# Altium schematic sheet BQ25798_PMIC.SchDoc
size A; SheetNumber: 3; SheetTotal: 6
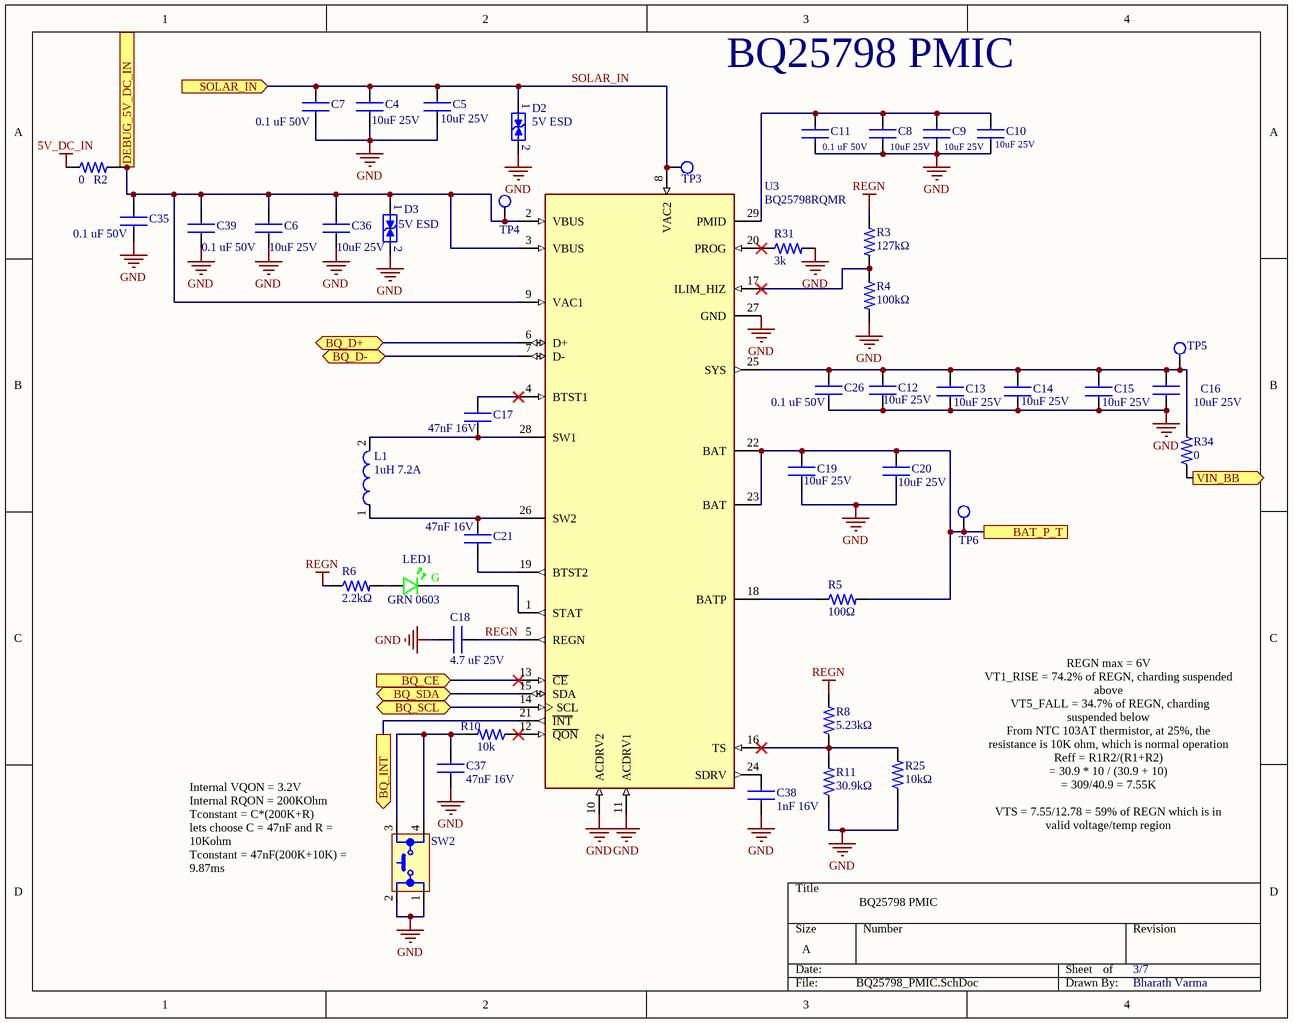
[diagram p0: BQ25798_PMIC.SchDoc]

## Parts
C4  10uF 25V  [CAP_10]
C5  10uF 25V  [CAP_10]
C6  10uF 25V  [CAP_10]
C7  0.1 uF 50V  [CAPC1608X90N]
C8  10uF 25V  [CAP_10]
C9  10uF 25V  [CAP_10]
C10  10uF 25V  [CAP_10]
C11  0.1 uF 50V  [CAPC1608X90N]
C12  10uF 25V  [CAP_10]
C13  10uF 25V  [CAP_10]
C14  10uF 25V  [CAP_10]
C15  10uF 25V  [CAP_10]
C16  10uF 25V  [CAP_10]
C17  47nF 16V  [CAPC1608X90N]
C18  4.7 uF 25V  [CAPC1608X90N]
C19  10uF 25V  [CAP_10]
C20  10uF 25V  [CAP_10]
C21  47nF 16V  [CAPC1608X90N]
C26  0.1 uF 50V  [CAPC1608X90N]
C35  0.1 uF 50V  [CAPC1608X90N]
C36  10uF 25V  [CAP_10]
C37  47nF 16V  [CAPC1608X90N]
C38  1nF 16V  [CAPC1608X90N]
C39  0.1 uF 50V  [CAPC1608X90N]
D2  5V ESD  [WE-TVS_DFN1610-2L]
D3  5V ESD  [WE-TVS_DFN1610-2L]
L1  1uH 7.2A  [WE-MAPI_4020]
LED1  GRN 0603  [LED_0603_GRN_WL-SMCW]
R2  0  [RES_0603_1608X06]
R3  127kΩ  [RESC1508X55N]
R4  100kΩ  [RESC1508X55N]
R5  100Ω  [RESC1508X55N]
R6  2.2kΩ  [RESC1508X55N]
R8  5.23kΩ  [RESC1508X55N]
R10  10k  [RES_0603_1608X06]
R11  30.9kΩ  [RESC1508X55N]
R25  10kΩ  [RES_0603_1608X06]
R31  3k  [RES_0603_1608X06]
R34  0  [RES_0603_1608X06]
SW2  (no value)  [1825910-6_BUTTON]
TP3  Test Point  [Test Point]  (value not drawn)  (net tie, no BOM)
TP4  Test Point  [Test Point]  (value not drawn)  (net tie, no BOM)
TP5  Test Point  [Test Point]  (value not drawn)  (net tie, no BOM)
TP6  Test Point  [Test Point]  (value not drawn)  (net tie, no BOM)
U3  BQ25798RQMR  [BQ25798RQMR]

## Ports
BAT_P_T (see mech_comp[2B]), BQ_CE (in, see ESP32_SoC[4C]), BQ_D+ (bidir, see CP2102_USB_UART[2C]), BQ_D- (bidir, see CP2102_USB_UART[2C]), BQ_INT (out, see ESP32_SoC[4B]), BQ_SCL (bidir, see ESP32_SoC[4B]), BQ_SDA (bidir, see ESP32_SoC[4B]), DEBUG_5V_DC_IN (in, see mech_comp[1C]), SOLAR_IN (in, see mech_comp[2B]), VIN_BB (out, see TPS_BUCK_BOOST[1B])

## Nets
5V_DC_IN: R2.1
GND: C4.2 C5.2 C6.2 C7.2 C8.2 C9.2 C10.2 C11.2 C12.2 C13.2 C14.2 C15.2 C16.2 C18.1 C19.2 C20.2 C26.2 C35.2 C36.2 C37.2 C38.2 C39.2 D2.2(GND) D3.2(GND) R4.2 R11.1 R25.1 R31.2 SW2.1 SW2.2 U3.10(ACDRV2) U3.11(ACDRV1) U3.27(GND)
REGN: C18.2 R3.1 R6.1 R8.2 U3.5(REGN)
BAT_P_T: C19.1 C20.1 R5.2 TP6.1 U3.22(BAT) U3.23(BAT) ; port BAT_P_T
BQ_CE: U3.13(~{CE}) ; port BQ_CE
BQ_D+: U3.6(D+) ; port BQ_D+
BQ_D-: U3.7(D-) ; port BQ_D-
BQ_INT: U3.21(~{INT}) ; port BQ_INT
BQ_SCL: U3.14(SCL) ; port BQ_SCL
BQ_SDA: U3.15(SDA) ; port BQ_SDA
DEBUG_5V_DC_IN: C6.1 C35.1 C36.1 C39.1 D3.1(I/O) R2.2 TP4.1 U3.2(VBUS) U3.3(VBUS) U3.9(VAC1) ; port DEBUG_5V_DC_IN
SOLAR_IN: C4.1 C5.1 C7.1 D2.1(I/O) TP3.1 U3.8(VAC2) ; port SOLAR_IN
VIN_BB: R34.1 ; port VIN_BB
NetC8_1: C8.1 C9.1 C10.1 C11.1 U3.29(PMID)
NetC12_1: C12.1 C13.1 C14.1 C15.1 C16.1 C26.1 R34.2 TP5.1 U3.25(SYS)
NetC17_1: C17.1 U3.4(BTST1)
NetC17_2: C17.2 L1.2 U3.28(SW1)
NetC21_1: C21.1 L1.1 U3.26(SW2)
NetC21_2: C21.2 U3.19(BTST2)
NetC37_1: C37.1 R10.2 SW2.3 SW2.4
NetC38_1: C38.1 U3.24(SDRV)
NetLED1_A: LED1.A R6.2
NetLED1_C: LED1.C U3.1(STAT)
NetR3_2: R3.2 R4.1 U3.17(ILIM_HIZ)
NetR5_1: R5.1 U3.18(BATP)
NetR8_1: R8.1 R11.2 R25.2 U3.16(TS)
NetR10_1: R10.1 U3.12(~{QON})
NetR31_1: R31.1 U3.20(PROG)

## Notes on the sheet
- BQ25798 PMIC
- REGN max = 6V
  VT1_RISE = 74.2% of REGN, charding suspended above
  VT5_FALL = 34.7% of REGN, charding suspended below
  From NTC 103AT thermistor, at 25%, the resistance is 10K ohm, which is normal operation
  Reff = R1R2/(R1+R2)
  = 30.9 * 10 / (30.9 + 10)
  = 309/40.9 = 7.55K
  VTS = 7.55/12.78 = 59% of REGN which is in valid voltage/temp region
- (near SW2) Internal VQON = 3.2V
  Internal RQON = 200KOhm
  Tconstant = C*(200K+R)
  lets choose C = 47nF and R = 10Kohm
  Tconstant = 47nF(200K+10K) = 9.87ms
- 3/7
- Bharath Varma
- (in symbol 150060GS75000) G

## Library data of the parts
C4-C6 C8-C10 C12-C16 C19 C20 C36 = GRM21BR61E106KA73K: Ceramic Capacitor, Ceramic, 25V, 10% +Tol, 10% -Tol, X5R, 15% TC, 10uF, Surface Mount, 0805; Manufacturer: Murata; Manufacturer Lifecycle Status: IN PRODUCTION; Value: 10µF; Supplier: Avnet; Supplier Part Number: GRM21BR61E106KA73K; Manufacturer Part Number: GRM21BR61E106KA73K; RoHS: Compliant; Category: Ceramic Capacitors; Stock: 54000; Pricing: 10000=0.01987, 20000=0.01911, 40000=0.01892, 60000=0.01882, 80000=0.01872 (USD); Case/Package: 0805; Dielectric: X5R; Dielectric Material: Ceramic; Height: 1.25mm; Length: 2mm; Lifecycle Status: Production; Material: Ceramic; Max Operating Temperature: 85°C; Min Operating Temperature: -55°C; Mounting Technology: Surface Mount; Number of Terminals: 2; Packaging: Tape & Reel (TR); REACH SVHC: Yes; Schedule B: 8532240020, 8532240020|8532240020, 8532240020|8532240020|8532240020, 8532240020|8532240020|8532240020|8532240020; Thickness: 1.25mm; Tolerance: 10%; Voltage Rating: 25V; Voltage Rating (DC): 25V; Weight: 9.49709mg; Width: 1.25mm; ComponentLink1URL: https://datasheet.octopart.com:443/GRM21BR61E106KA73K-Murata-datasheet-149523495.pdf?src-supplier=Newark; ComponentLink1Description: https://datasheet.octopart.com:443/GRM21BR61E106KA73K-Murata-datasheet-149523495.pdf?src-supplier=Newark; ComponentLink2URL: https://datasheet.octopart.com:443/GRM21BR61E106KA73K-Murata-datasheet-141278247.pdf?src-supplier=Geoflip; ComponentLink2Description: https://datasheet.octopart.com:443/GRM21BR61E106KA73K-Murata-datasheet-141278247.pdf?src-supplier=Geoflip; ComponentLink3URL: https://datasheet.octopart.com:443/GRM21BR61E106KA73K-Murata-datasheet-165579666.pdf?src-supplier=TME; ComponentLink3Description: https://datasheet.octopart.com:443/GRM21BR61E106KA73K-Murata-datasheet-165579666.pdf?src-supplier=TME; ComponentLink4URL: https://datasheet.octopart.com:443/GRM21BR61E106KA73K-Murata-datasheet-140707569.pdf?src-supplier=Ciiva; ComponentLink4Description: https://datasheet.octopart.com:443/GRM21BR61E106KA73K-Murata-datasheet-140707569.pdf?src-supplier=Ciiva; ComponentLink5URL: https://datasheet.octopart.com:443/GRM21BR61E106KA73K-Murata-datasheet-138744870.pdf?src-supplier=Ciiva; ComponentLink5Description: https://datasheet.octopart.com:443/GRM21BR61E106KA73K-Murata-datasheet-138744870.pdf?src-supplier=Ciiva; ComponentLink6URL: https://datasheet.octopart.com:443/GRM21BR61E106KA73K-Murata-datasheet-99353849.pdf?src-supplier=Future+Electronics; ComponentLink6Description: https://datasheet.octopart.com:443/GRM21BR61E106KA73K-Murata-datasheet-99353849.pdf?src-supplier=Future+Electronics; ComponentLink7URL: https://datasheet.octopart.com/GRM21BR61E106KA73K-Murata-datasheet-12515295.pdf; ComponentLink7Description: https://datasheet.octopart.com/GRM21BR61E106KA73K-Murata-datasheet-12515295.pdf; ComponentLink8URL: https://datasheet.octopart.com/GRM21BR61E106KA73K-Murata-datasheet-12510076.pdf; ComponentLink8Description: https://datasheet.octopart.com/GRM21BR61E106KA73K-Murata-datasheet-12510076.pdf; ComponentLink9URL: https://datasheet.octopart.com/GRM21BR61E106KA73K-Murata-datasheet-11978611.pdf; ComponentLink9Description: https://datasheet.octopart.com/GRM21BR61E106KA73K-Murata-datasheet-11978611.pdf; ComponentLink10URL: https://datasheet.octopart.com/GRM21BR61E106KA73K-Murata-datasheet-10025737.pdf; ComponentLink10Description: https://datasheet.octopart.com/GRM21BR61E106KA73K-Murata-datasheet-10025737.pdf; ComponentLink11URL: https://datasheet.octopart.com/GRM21BR61E106KA73K-Murata-datasheet-8819587.pdf; ComponentLink11Description: https://datasheet.octopart.com/GRM21BR61E106KA73K-Murata-datasheet-8819587.pdf; ComponentLink12URL: https://datasheet.octopart.com/GRM21BR61E106KA73K-Murata-datasheet-14397508.pdf; ComponentLink12Description: https://datasheet.octopart.com/GRM21BR61E106KA73K-Murata-datasheet-14397508.pdf; ComponentLink13URL: http://sigma.octopart.com:80/reach_statement/Murata-company-16.pdf?src-supplier=Compliance+Statements; ComponentLink13Description: http://sigma.octopart.com:80/reach_statement/Murata-company-16.pdf?src-supplier=Compliance+Statements; Supplier 1: DigiKey; Supplier Part Number 1: 490-16824-1-ND
C7 C11 C26 C35 C39 = GCM31C5C1H104FA16L: 0.10uF Tol.1%. Rated voltage 50Vdc 125C SMD capacitor C0G(EIA) with capacitance; MF: Murata; Check_prices: https://www.snapeda.com/parts/GCM31C5C1H104FA16L/Murata/view-part/?ref=eda; Value: *; MP: GCM31C5C1H104FA16L; Purchase-URL: https://pricing.snapeda.com/search/part/GCM31C5C1H104FA16L/?ref=eda; SnapEDA_Link: https://www.snapeda.com/parts/GCM31C5C1H104FA16L/Murata/view-part/?ref=snap; Package: 3216 Murata; Digi-Key_Part_Number: 490-GCM31C5C1H104FA16LTR-ND
C17 C21 C37 = CC0603KRX7R7BB473: CAPACITOR CERAMIC 0.047UF 16V, X7R, 10%,; Package: None; Price: None; Value: *; MP: CC0603KRX7R7BB473; Availability: Unavailable
C18 = GRM188R61E475KE11D: Ceramic capacitor SMD 0603 4.7 µF 25 V 10 % (L x W x H) 1.6 x 0.8 x 0.8 mm Murata GRM188R61E475KE11D 4000 pc(s); MF: Murata Electronics; SnapEDA_Link: https://www.snapeda.com/parts/GRM188R61E475KE11D/Murata+Electronics+North+America/view-part/?ref=snap; Package: 1608 Murata; Value: *; MP: GRM188R61E475KE11D; Check_prices: https://www.snapeda.com/parts/GRM188R61E475KE11D/Murata+Electronics+North+America/view-part/?ref=eda
C38 = CC0603KRX7R7BB102: 1000pF ±10% 16V Ceramic Capacitor X7R 0603 (1608 Metric); MF: Yageo; Digi-Key_Part_Number: 311-4063-1-ND; Check_prices: https://www.snapeda.com/parts/CC0603KRX7R7BB102/Yageo/view-part/1821143/?ref=eda; Package: 0603 Yageo; Purchase-URL: https://pricing.snapeda.com/search/part/CC0603KRX7R7BB102/?ref=eda; Value: *; MP: CC0603KRX7R7BB102; SnapEDA_Link: https://www.snapeda.com/parts/CC0603KRX7R7BB102/Yageo/view-part/1821143/?ref=snap
D2 D3 = WE-TVS_DFN1610-2L_824032815: MF: {'manufacturer': u'W\xfcrth Elektronik'}; Package: None; Price: None; Value: *; MP: 824032815; Availability: Unavailable
L1 = WE-MAPI_4020: 1 ÂµH Shielded Molded Inductor 7.2 A 15mOhm Max 1616 (4040 Metric); MF: WÃ¼rth Elektronik; MP: 74438356010; Package: SMD-2; Price: None; Value: *; SnapEDA_Link: https://www.snapeda.com/parts/74438356010/W%25C3%25BCrth+Elektronik+Midcom/view-part/?ref=snap; Availability: Unavailable; Check_prices: https://www.snapeda.com/parts/74438356010/W%25C3%25BCrth+Elektronik+Midcom/view-part/?ref=eda
LED1 = 150060GS75000: LED, 0603, GREEN, 430MCD, 520NM; Manufacturer: Wurth Electronics; Dynamic Catalog: 0603 Rectangle with Flat Top Chip LEDs; 3D Model: SMCW_0603.igs / SMCW_0603.stp / SMCW_0603.wrl; Wavelength - Peak: 515nm; Voltage - Forward (Vf) (Typ): 3.2V; Current - Test: 20mA; Viewing Angle: 140°; Lens Type: Clear; Lens Style/Size: Rectangle with Flat Top, 1.1mm x 0.7mm; Other Names: 732-4971-2; Supplier 1: Digi-Key; Manufacturer Part Number: 150060GS75000; Stock 1: 34964; Pricing 1: 1=0.14, 50=0.129, 100=0.11, 500=0.095 (USD); Standard Package: 4,000; Category: Optoelectronics; Family: LED Indication - Discrete; Series: WL-SMCW; Packaging: Tape & Reel (TR); Color: Green; Wavelength - Dominant: 520nm; Millicandela Rating: 430mcd; Package / Case: 0603 (1608 Metric); Size / Dimension: 1.60mm L x 0.80mm W; Height: 0.70mm; Mounting Type: Surface Mount; Online Catalog: 0603 Rectangle with Flat Top Chip LEDs; ComponentLink1URL: https://katalog.we-online.de/led/datasheet/150060GS75000.pdf?src-supplier=Digi-Key; ComponentLink1Description: https://katalog.we-online.de/led/datasheet/150060GS75000.pdf?src-supplier=Digi-Key; ComponentLink2URL: http://www.produktinfo.conrad.com/datenblaetter/750000-774999/759427-da-01-en-CHIPLED_0603_W_KL_GRUEN_150060GS75000.pdf?src-supplier=Conrad; ComponentLink2Description: http://www.produktinfo.conrad.com/datenblaetter/750000-774999/759427-da-01-en-CHIPLED_0603_W_KL_GRUEN_150060GS75000.pdf?src-supplier=Conrad; Supplier Part Number 1: 732-4971-1-ND
R2 R34 = MCT06030Z0000ZP500: 0 Ohms Jumper 0.125W, 1/8W Chip Resistor 0603 (1608 Metric) Anti-Sulfur Thin Film; MF: Vishay; SnapEDA_Link: https://www.snapeda.com/parts/MCT06030Z0000ZP500/Vishay+Beyschlag/view-part/?ref=snap; Package: 1508 Vishay; Value: *; MP: MCT06030Z0000ZP500; Check_prices: https://www.snapeda.com/parts/MCT06030Z0000ZP500/Vishay+Beyschlag/view-part/?ref=eda
R3 = RMCF0603FT127K: RES 127K OHM 1% 1/10W 0603; Package: None; Price: None; Value: *; MP: RMCF0603FT127K; Availability: Unavailable
R4 = RMCF0603JT100K: RMCF Series 0603 0.1 W 100 kOhm Â±5 % Â±100 ppm/Â°C SMT Thick Film Chip Resistor; MF: Stackpole Electronics; Package: 0603 Stackpole Electronics; Value: *; MP: RMCF0603JT100K; Price: None; Availability: Good; SnapEDA_Link: https://www.snapeda.com/parts/RMCF0603JT100K/Stackpole%20Electronics/view-part/54539/?ref=snap; Purchase-URL: https://pricing.snapeda.com/search/part/RMCF0603JT100K/?ref=eda
R5 = RN73H1JTTD1000B25: RES 100 OHM 0.1% 1/10W 0603; Package: None; Price: None; Value: *; MP: RN73H1JTTD1000B25; Availability: Unavailable
R6 = RN73H1JTTD2201F50: RES 2.2K OHM 1% 1/10W 0603; Package: None; Price: None; Value: *; MP: RN73H1JTTD2201F50; Availability: Unavailable
R8 = RC0603FR-075K23L: 5.23 kOhms ±1% 0.1W, 1/10W Chip Resistor 0603 (1608 Metric) Moisture Resistant Thick Film; MF: {'manufacturer': u'YAGEO'}; Package: None; Price: None; Value: *; MP: RC0603FR-075K23L; Availability: Unavailable
R10 = RNCP0603FTD10K0: 10 kOhms Â±1% 0.125W, 1/8W Chip Resistor 0603 (1608 Metric) Anti-Sulfur, Moisture Resistant Thin Film; MF: Stackpole Electronics Inc; SnapEDA_Link: https://www.snapeda.com/parts/RNCP0603FTD10K0/Stackpole+Electronics/view-part/?ref=snap; Package: 1508 Stackpole; Value: *; MP: RNCP0603FTD10K0; Check_prices: https://www.snapeda.com/parts/RNCP0603FTD10K0/Stackpole+Electronics/view-part/?ref=eda
R11 = RC0603FR-0730K9L: 30,9K 1% 0,1W RC0603; Package: None; Price: None; Value: *; MP: RC0603FR-0730K9L; Availability: Unavailable
R25 = RC0603FR-0710KL: 100mW Thick Film Resistors 75V ±100ppm/℃ ±1% 10kΩ 0603 Chip Resistor - Surface Mount ROHS; Manufacturer: Yageo Group; Temperature Coefficient: 100ppm/°C; Voltage Rating (DC): 50V; Supplier: DigiKey; Supplier Part Number: 311-10.0KHRCT-ND; Manufacturer Part Number: RC0603FR-0710KL; RoHS: Compliant; Category: Chip SMD Resistors; Stock: 15482043; Pricing: 1=0.1, 10=0.009, 25=0.0088, 50=0.0052, 5000=0.00408, 10000=0.00306, 25000=0.00303, 35000=0.00288, 50000=0.00275, 60000=0.00268, 120000=0.00247, 125000=0.00246 (USD); Case/Package: 0603; Case Code (Imperial): 0603; Case Code (Metric): 0603; China RoHS: Non-Compliant; Composition: Thick Film; Depth: 800µm; Height: 450µm; Lead Free: Lead Free; Lead Pitch: 300µm; Length: 1.6mm; Lifecycle Status: Production; Max Operating Temperature: 155°C; Military Standard: Not; Min Operating Temperature: -55°C; Mounting Technology: Surface Mount; Pins: 2; Number of Terminals: 2; Packaging: Tape & Reel; Power Dissipation: 100mW; Power Rating: 100mW; REACH SVHC: Yes; Value: 10kΩ; Schedule B: 8533210045, 8533210045|8533210045|8533210045|8533210045|8533210045|8533210045|8533210045|8533210045|8533210045|8533210045|8533210045|8533210045|8533210045|8533210045|8533210045|8533210045|8533210045|8533210045|8533210045|8533210045|8533210045|8533210045|8533210045|85; Termination: SMD/SMT; Tolerance: 1%; Voltage Rating: 75V; Weight: 2.012816mg; Width: 800µm; Working Voltage: 75V; ComponentLink1URL: https://datasheet.octopart.com:443/RC0603FR-0710KL-Yageo-datasheet-175887523.pdf?src-supplier=IHS; ComponentLink1Description: https://datasheet.octopart.com:443/RC0603FR-0710KL-Yageo-datasheet-175887523.pdf?src-supplier=IHS; ComponentLink2URL: https://datasheet.octopart.com:443/RC0603FR-0710KL-Yageo-datasheet-103092701.pdf?src-supplier=Upverter; ComponentLink2Description: https://datasheet.octopart.com:443/RC0603FR-0710KL-Yageo-datasheet-103092701.pdf?src-supplier=Upverter; ComponentLink3URL: https://datasheet.octopart.com:443/RC0603FR-0710KL-Yageo-datasheet-98239111.pdf?src-supplier=Upverter; ComponentLink3Description: https://datasheet.octopart.com:443/RC0603FR-0710KL-Yageo-datasheet-98239111.pdf?src-supplier=Upverter; ComponentLink4URL: https://datasheet.octopart.com:443/RC0603FR-0710KL-Yageo-datasheet-141265859.pdf?src-supplier=Upverter; ComponentLink4Description: https://datasheet.octopart.com:443/RC0603FR-0710KL-Yageo-datasheet-141265859.pdf?src-supplier=Upverter; ComponentLink5URL: https://sigma.octopart.com:443/138820526/technical_drawing/Yageo-RC0603FR-0710KL.pdf?src-supplier=Upverter; ComponentLink5Description: https://sigma.octopart.com:443/138820526/technical_drawing/Yageo-RC0603FR-0710KL.pdf?src-supplier=Upverter; ComponentLink6URL: https://datasheet.octopart.com:443/RC0603FR-0710KL-Yageo-datasheet-8328172.pdf?src-supplier=Farnell; ComponentLink6Description: https://datasheet.octopart.com:443/RC0603FR-0710KL-Yageo-datasheet-8328172.pdf?src-supplier=Farnell; ComponentLink7URL: https://datasheet.octopart.com:443/RC0603FR-0710KL-Yageo-datasheet-13691069.pdf?src-supplier=Farnell; ComponentLink7Description: https://datasheet.octopart.com:443/RC0603FR-0710KL-Yageo-datasheet-13691069.pdf?src-supplier=Farnell; ComponentLink8URL: https://datasheet.octopart.com:443/RC0603FR-0710KL-Yageo-datasheet-62067350.pdf?src-supplier=element14+APAC; ComponentLink8Description: https://datasheet.octopart.com:443/RC0603FR-0710KL-Yageo-datasheet-62067350.pdf?src-supplier=element14+APAC; ComponentLink9URL: https://datasheet.octopart.com:443/RC0603FR-0710KL-Yageo-datasheet-17842380.pdf?src-supplier=element14+APAC; ComponentLink9Description: https://datasheet.octopart.com:443/RC0603FR-0710KL-Yageo-datasheet-17842380.pdf?src-supplier=element14+APAC; ComponentLink10URL: https://datasheet.octopart.com:443/RC0603FR-0710KL-Yageo-datasheet-15599030.pdf?src-supplier=Future+Electronics; ComponentLink10Description: https://datasheet.octopart.com:443/RC0603FR-0710KL-Yageo-datasheet-15599030.pdf?src-supplier=Future+Electronics; ComponentLink11URL: https://datasheet.octopart.com:443/RC0603FR-0710KL-Yageo-datasheet-164759695.pdf?src-supplier=Future+Electronics; ComponentLink11Description: https://datasheet.octopart.com:443/RC0603FR-0710KL-Yageo-datasheet-164759695.pdf?src-supplier=Future+Electronics; ComponentLink12URL: https://datasheet.octopart.com:443/RC0603FR-0710KL-Yageo-datasheet-127823281.pdf?src-supplier=Future+Electronics; ComponentLink12Description: https://datasheet.octopart.com:443/RC0603FR-0710KL-Yageo-datasheet-127823281.pdf?src-supplier=Future+Electronics; ComponentLink13URL: https://datasheet.octopart.com:443/RC0603FR-0710KL-Yageo-datasheet-137700087.pdf?src-supplier=Future+Electronics; ComponentLink13Description: https://datasheet.octopart.com:443/RC0603FR-0710KL-Yageo-datasheet-137700087.pdf?src-supplier=Future+Electronics; ComponentLink14URL: https://datasheet.octopart.com:443/RC0603FR-0710KL-Yageo-datasheet-27584510.pdf?src-supplier=Future+Electronics; ComponentLink14Description: https://datasheet.octopart.com:443/RC0603FR-0710KL-Yageo-datasheet-27584510.pdf?src-supplier=Future+Electronics; ComponentLink15URL: https://datasheet.octopart.com:443/RC0603FR-0710KL-Yageo-datasheet-8324193.pdf?src-supplier=Future+Electronics; ComponentLink15Description: https://datasheet.octopart.com:443/RC0603FR-0710KL-Yageo-datasheet-8324193.pdf?src-supplier=Future+Electronics; ComponentLink16URL: https://datasheet.octopart.com:443/RC0603FR-0710KL-Yageo-datasheet-12596169.pdf?src-supplier=Newark; ComponentLink16Description: https://datasheet.octopart.com:443/RC0603FR-0710KL-Yageo-datasheet-12596169.pdf?src-supplier=Newark; ComponentLink17URL: https://datasheet.octopart.com:443/RC0603FR-0710KL-Yageo-datasheet-503470.pdf?src-supplier=Newark; ComponentLink17Description: https://datasheet.octopart.com:443/RC0603FR-0710KL-Yageo-datasheet-503470.pdf?src-supplier=Newark; ComponentLink18URL: https://datasheet.octopart.com:443/RC0603FR-0710KL-Yageo-datasheet-34211833.pdf?src-supplier=Newark; ComponentLink18Description: https://datasheet.octopart.com:443/RC0603FR-0710KL-Yageo-datasheet-34211833.pdf?src-supplier=Newark; ComponentLink19URL: https://datasheet.octopart.com:443/RC0603FR-0710KL-Yageo-datasheet-79472498.pdf?src-supplier=Megastar; ComponentLink19Description: https://datasheet.octopart.com:443/RC0603FR-0710KL-Yageo-datasheet-79472498.pdf?src-supplier=Megastar; ComponentLink20URL: https://datasheet.octopart.com/RC0603FR-0710KL-Yageo-datasheet-73766026.pdf; ComponentLink20Description: https://datasheet.octopart.com/RC0603FR-0710KL-Yageo-datasheet-73766026.pdf; ComponentLink21URL: https://datasheet.octopart.com:443/RC0603FR-0710KL-Yageo-datasheet-118562.pdf?src-supplier=DigiKey; ComponentLink21Description: https://datasheet.octopart.com:443/RC0603FR-0710KL-Yageo-datasheet-118562.pdf?src-supplier=DigiKey; ComponentLink22URL: http://sigma.octopart.com:80/rohs_statement/Yageo-company-2.pdf?src-supplier=Compliance+Statements; ComponentLink22Description: http://sigma.octopart.com:80/rohs_statement/Yageo-company-2.pdf?src-supplier=Compliance+Statements; ComponentLink23URL: http://sigma.octopart.com:80/conflict_mineral_statement/Yageo-company-3.pdf?src-supplier=Compliance+Statements; ComponentLink23Description: http://sigma.octopart.com:80/conflict_mineral_statement/Yageo-company-3.pdf?src-supplier=Compliance+Statements
R31 = RMCF0603JT3K00: 3k ohm; Package: None; Price: None; Value: *; MP: RMCF0603JT3K00; Availability: Unavailable
SW2 = 1825910-6: SWITCH TACTILE SPST-NO 0.05A 24V; Manufacturer: TE Connectivity Alcoswitch; Actuator Material: PBT; Mechanical Life: 100000Cycles; Operating Force: 160gf; Throw Configuration: SPST; Illumination Type: Non-Illuminated,Illuminated; Switch Travel: 0.25mm; Switch Function: Off-Mom; Contact Current Rating: 50mA; Actuator Type: Standard; Contact Resistance: 100mR; Actuator Length: 0.055inch; Manufacturer Part Number: 1825910-6; RoHS: Yes; Category: Pushbutton Switches; Stock 1: 97530; Pricing 1: 1=0,10000, 10=0,10100, 25=0,09560, 100=0,08700, 250=0,08180, 500=0,07484, 1000=0,06265, 2500=0,06092, 5000=0,05743 (USD); Mount: Through Hole; Contact Material: Copper Alloy; Contact Plating: Silver; Min Operating Temperature: -35°C; Max Operating Temperature: 85°C; Termination: PC Pins; Package Quantity: 750; Packaging: Loose Piece; Orientation: Straight; Max Voltage Rating (DC): 24V; Electrical Life: 100000Cycles; Max Current Rating: 50mA; Type: Switch; Length: 5.99mm; REACH SVHC: Unknown; ELV: Compliant; Lead Free: Lead Free; ComponentLink1URL: https://datasheet.ciiva.com/30199/1825910-6rqpn1825910-6-30199520.pdf?src-supplier=Onlinecomponents.com; ComponentLink1Description: https://datasheet.ciiva.com/30199/1825910-6rqpn1825910-6-30199520.pdf?src-supplier=Onlinecomponents.com; ComponentLink2URL: https://datasheet.ciiva.com/15184/getdatasheetpartid-395915-15184509.pdf?src-supplier=Verical; ComponentLink2Description: https://datasheet.ciiva.com/15184/getdatasheetpartid-395915-15184509.pdf?src-supplier=Verical; Supplier 1: Digi-Key; Supplier Part Number 1: 450-1650-ND
U3 = BQ25798RQMR: IÂ²C controlled, 1-4-cell, 5-A buck-boost solar battery charger with dual-input selector and MPPT; MF: Texas Instruments; SnapEDA_Link: https://www.snapeda.com/parts/BQ25798RQMR/Texas+Instruments/view-part/?ref=snap; Package: VFQFN-29 Texas Instruments; Value: *; MP: BQ25798RQMR; Check_prices: https://www.snapeda.com/parts/BQ25798RQMR/Texas+Instruments/view-part/?ref=eda